# EAGLE design 32nbIoT (EAGLE 9.0.0)
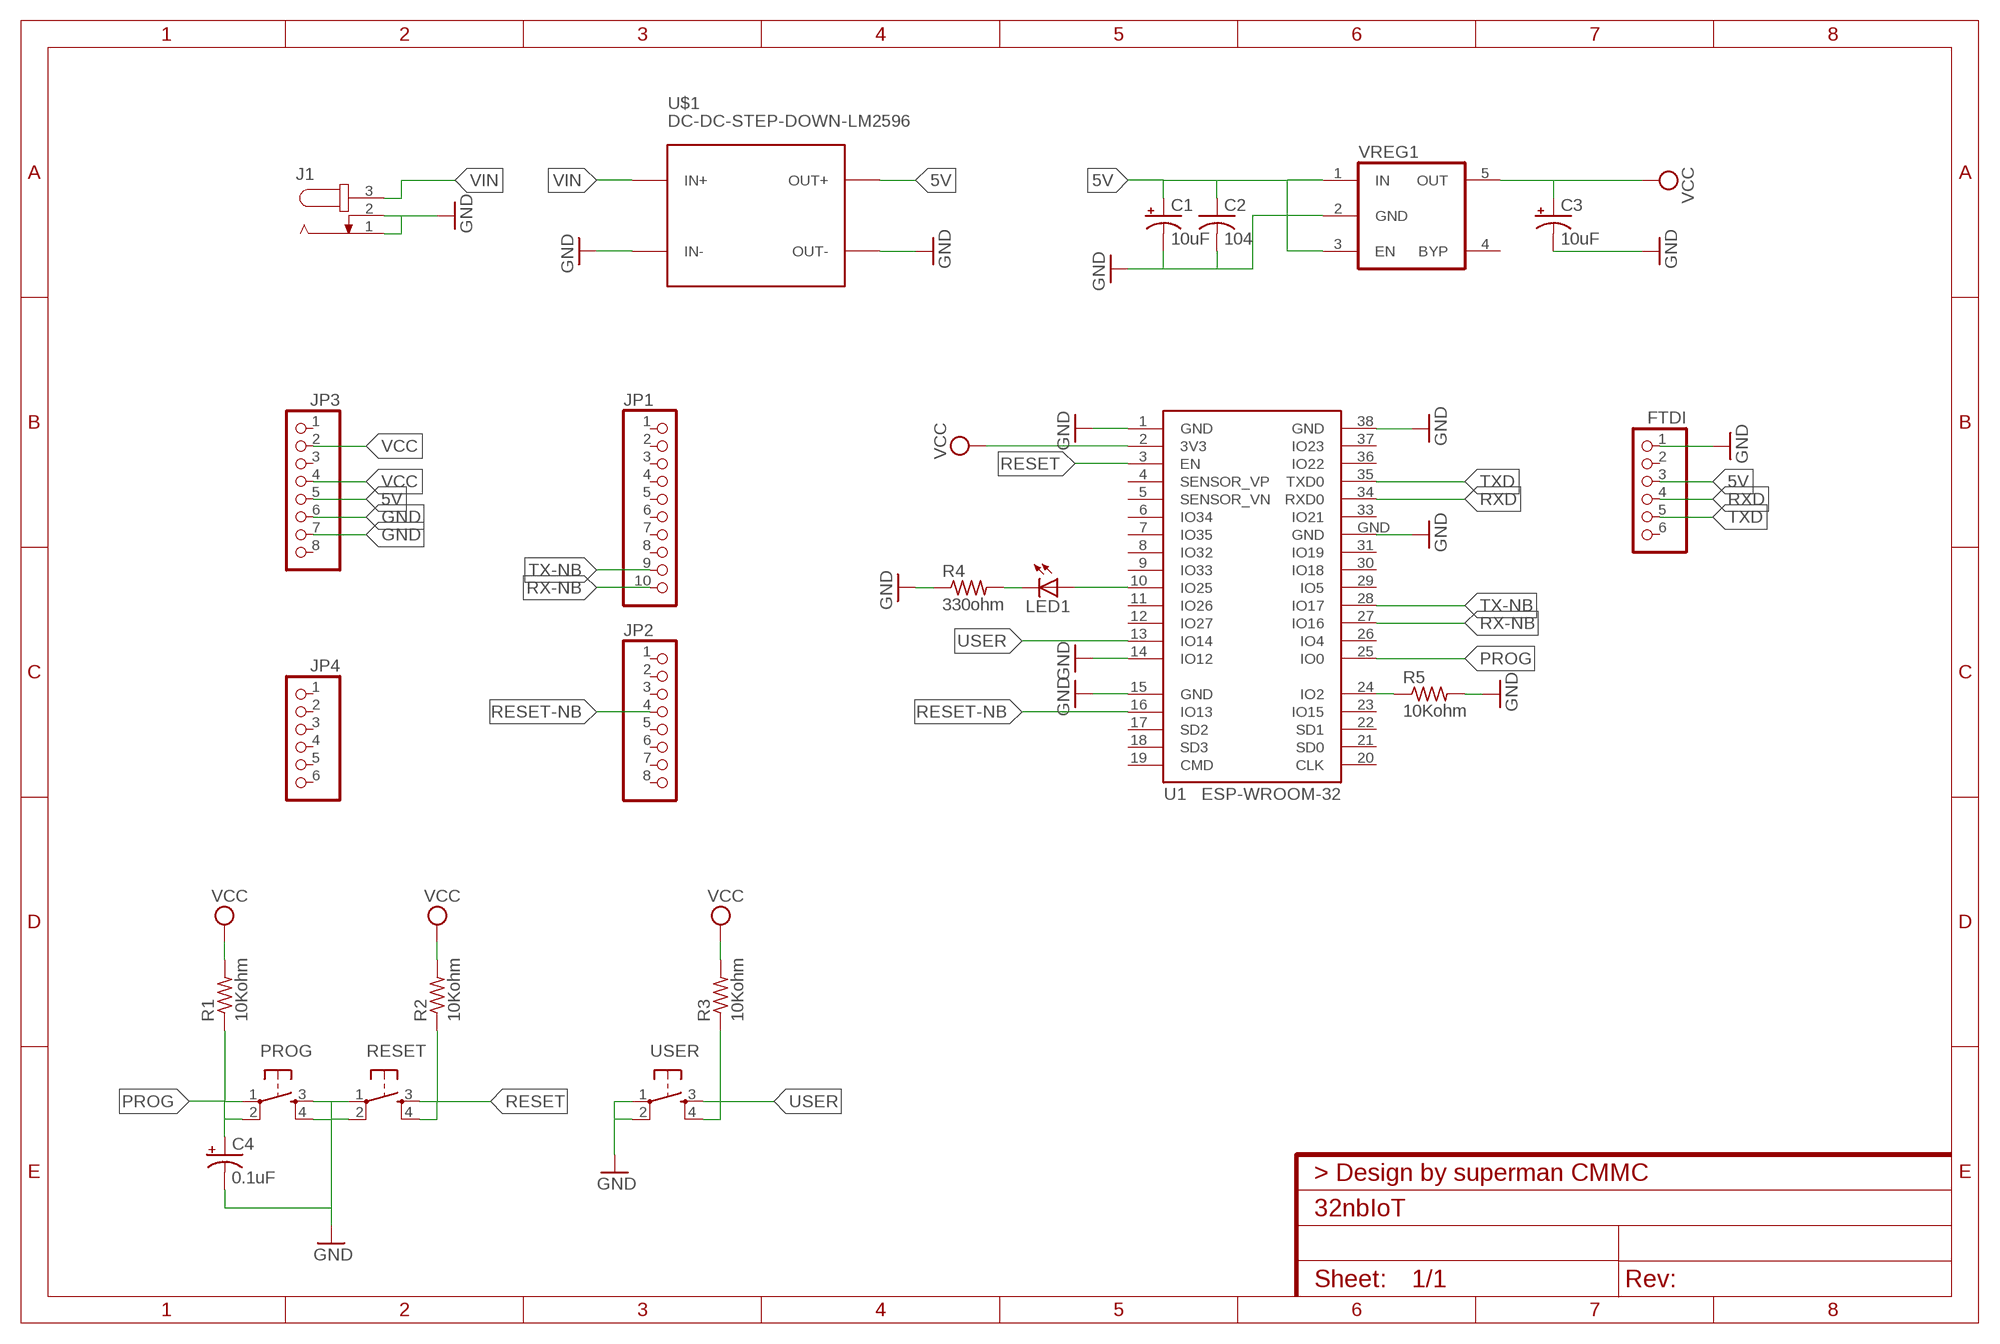
[diagram p0: schematic, sheet 1]

## Parts
C1  10uF  CPOL-USE2.5-6  [E2,5-6]
C2  104  C-US050-024X044  [C050-024X044]
C3  10uF  CPOL-USE2.5-6  [E2,5-6]
C4  0.1uF  CPOL-USE2.5-6  [E2,5-6]
FTDI  PINHD-1X6  [1X06]
J1  JACK-PLUG1  [SPC4078]
JP1  PINHD-1X10  [1X10]
JP2  PINHD-1X8  [1X08]
JP3  PINHD-1X8  [1X08]
JP4  PINHD-1X6  [1X06]
LED1  LED5MM  [LED5MM]
PROG  TAC_SWITCHPTH  [TACTILE-PTH]
R1  10Kohm  R-US_0207/10  [0207/10]
R2  10Kohm  R-US_0207/10  [0207/10]
R3  10Kohm  R-US_0207/10  [0207/10]
R4  330ohm  R-US_0207/10  [0207/10]
R5  10Kohm  R-US_0207/10  [0207/10]
RESET  TAC_SWITCHPTH  [TACTILE-PTH]
U1  ESP-WROOM-32  [ESP-WROOM-32]
U$1  DC-DC-STEP-DOWN-LM2596  [DC-DC-STEP-DOWN-LM2596]
USER  TAC_SWITCHPTH  [TACTILE-PTH]
VREG1  VREG_5PINS-SOT-23-5  [SOT-23-5]

## Nets
5V: C1.+ C2.1 FTDI.3 JP3.5 U$1.OUT+ VREG1.1(IN) VREG1.3(EN)
GND: C1.- C2.2 C3.- C4.- FTDI.1 J1.1 J1.2 JP3.6 JP3.7 PROG.3 PROG.4 R4.1 R5.2 RESET.1 RESET.2 U1.1(GND) U1.14(IO12) U1.15(GND) U1.38(GND) U1.GND U$1.IN- U$1.OUT- USER.1 USER.2 VREG1.2(GND)
N$1: LED1.K(C) R4.2
N$2: LED1.A U1.10(IO25)
N$3: R5.1 U1.24(IO2)
PROG: C4.+ PROG.1 PROG.2 R1.1 U1.25(IO0)
RESET: R2.1 RESET.3 RESET.4 U1.3(EN)
RESET-NB: JP2.4 U1.16(IO13)
RX-NB: JP1.10 U1.27(IO16)
RXD: FTDI.4 U1.34(RXD0)
TX-NB: JP1.9 U1.28(IO17)
TXD: FTDI.5 U1.35(TXD0)
USER: R3.1 U1.13(IO14) USER.3 USER.4
VCC: C3.+ JP3.2 JP3.4 R1.2 R2.2 R3.2 U1.2(3V3) VREG1.5(OUT)
VIN: J1.3 U$1.IN+
Unconnected: FTDI.2 FTDI.6 JP1.1 JP1.2 JP1.3 JP1.4 JP1.5 JP1.6 JP1.7 JP1.8 JP2.1 JP2.2 JP2.3 JP2.5 JP2.6 JP2.7 JP2.8 JP3.1 JP3.3 JP3.8 JP4.1 JP4.2 JP4.3 JP4.4 JP4.5 JP4.6 U1.4(SENSOR_VP) U1.5(SENSOR_VN) U1.6(IO34) U1.7(IO35) U1.8(IO32) U1.9(IO33) U1.11(IO26) U1.12(IO27) U1.17(SD2) U1.18(SD3) U1.19(CMD) U1.20(CLK) U1.21(SD0) U1.22(SD1) U1.23(IO15) U1.26(IO4) U1.29(IO5) U1.30(IO18) U1.31(IO19) U1.33(IO21) U1.36(IO22) U1.37(IO23) VREG1.4(BYP)

## Library data of the parts
C1 C3 C4 = adafruit:CPOL-US: POLARIZED CAPACITOR, American symbol
C2 = rcl:C-US: CAPACITOR, American symbol; SPICEPREFIX: C
FTDI JP4 = pinhead:PINHD-1X6: PIN HEADER
J1 = con-jack:JACK-PLUG: DC POWER JACK Power Jack, DC, Right Angle, Through Hole, Rated 5A at 16VDC, PC Terminals Distributor: Farnell (www.Farnell.de) Drawing: 84N1161.pdf / 84N1162.pdf Manufacturer: SPC Technology (www.spctechnology.com) Type: SPC4077 / SPC 4078; OC_FARNELL: unknown; OC_NEWARK: unknown
JP1 = pinhead:PINHD-1X10: PIN HEADER
JP2 JP3 = pinhead:PINHD-1X8: PIN HEADER
LED1 = adafruit:LED: LED OSRAM: - CHIPLED LG R971, LG N971, LY N971, LG Q971, LY Q971, LO R971, LY R971 LH N974, LH R974 LS Q976, LO Q976, LY Q976 LO Q996 - Hyper CHIPLED LW Q18S LB Q993, LB Q99A, LB R99A - SideLED LS A670, LO A670, LY A670, LG A670, LP A670 LB A673, LV A673, LT A673, LW A673 LH A674 LY A675 LS A676, LA A676, LO A676, LY A676, LW A676 LS A679, LY A679, LG A679 - Hyper Micro SIDELED® LS Y876, LA Y876, LO Y876, LY Y876 LT Y87S - SmartLED LW L88C, LW L88S LB L89C, LB L89S, LG L890 LS L89K, LO L89K, LY L89K LS L896, LA L896, LO L896, LY L896 - TOPLED LS T670, LO T670, LY T670, LG T670, LP T670 LSG T670, LSP T670, LSY T670, LOP T670, LYG T670 LG T671, LOG T671, LSG T671 LB T673, LV T673, LT T673, LW T673 LH T674 LS T676, LA T676, LO T676, LY T676, LB T676, LH T676, LSB T676, LW T676 LB T67C, LV T67C, LT T67C, LS T67K, LO T67K, LY T67K, LW E67C LS E67B, LA E67B, LO E67B, LY E67B, LB E67C, LV E67C, LT E67C LW T67C LS T679, LY T679, LG T679 LS T770, LO T770, LY T770, LG T770, LP T770 LB T773, LV T773, LT T773, LW T773 LH T774 LS E675, LA E675, LY E675, LS T675 LS T776, LA T776, LO T776, LY T776, LB T776 LHGB T686 LT T68C, LB T68C - Hyper Mini TOPLED® LB M676 - Mini TOPLED Santana® LG M470 LS M47K, LO M47K, LY M47K Source: http://www.osram.convergy.de/
PROG RESET USER = SparkFun-Retired:TAC_SWITCH: Momentary Switch Button commonly used for reset or general input. Spark Fun Electronics SKU : COM-00097 SMT- SWCH-08247
R1-R5 = adafruit:R-US_: RESISTOR, American symbol
U1 = esp32:ESP-WROOM-32: Espressif Systems ESP-WROOM-32
U$1 = diy-modules:DC-DC-STEP-DOWN-LM2596: DC/DC Step-Down Regulator based on LM2596-ADJ chip LM2596 datasheet available here: http://www.ti.com/lit/ds/symlink/lm2596.pdf Click here to find device on ebay.com <http://www.ebay.com/sch/lm2596+power+regulator>
VREG1 = dp_devices:VREG_5PINS: 5 pins voltage regulator

## Board
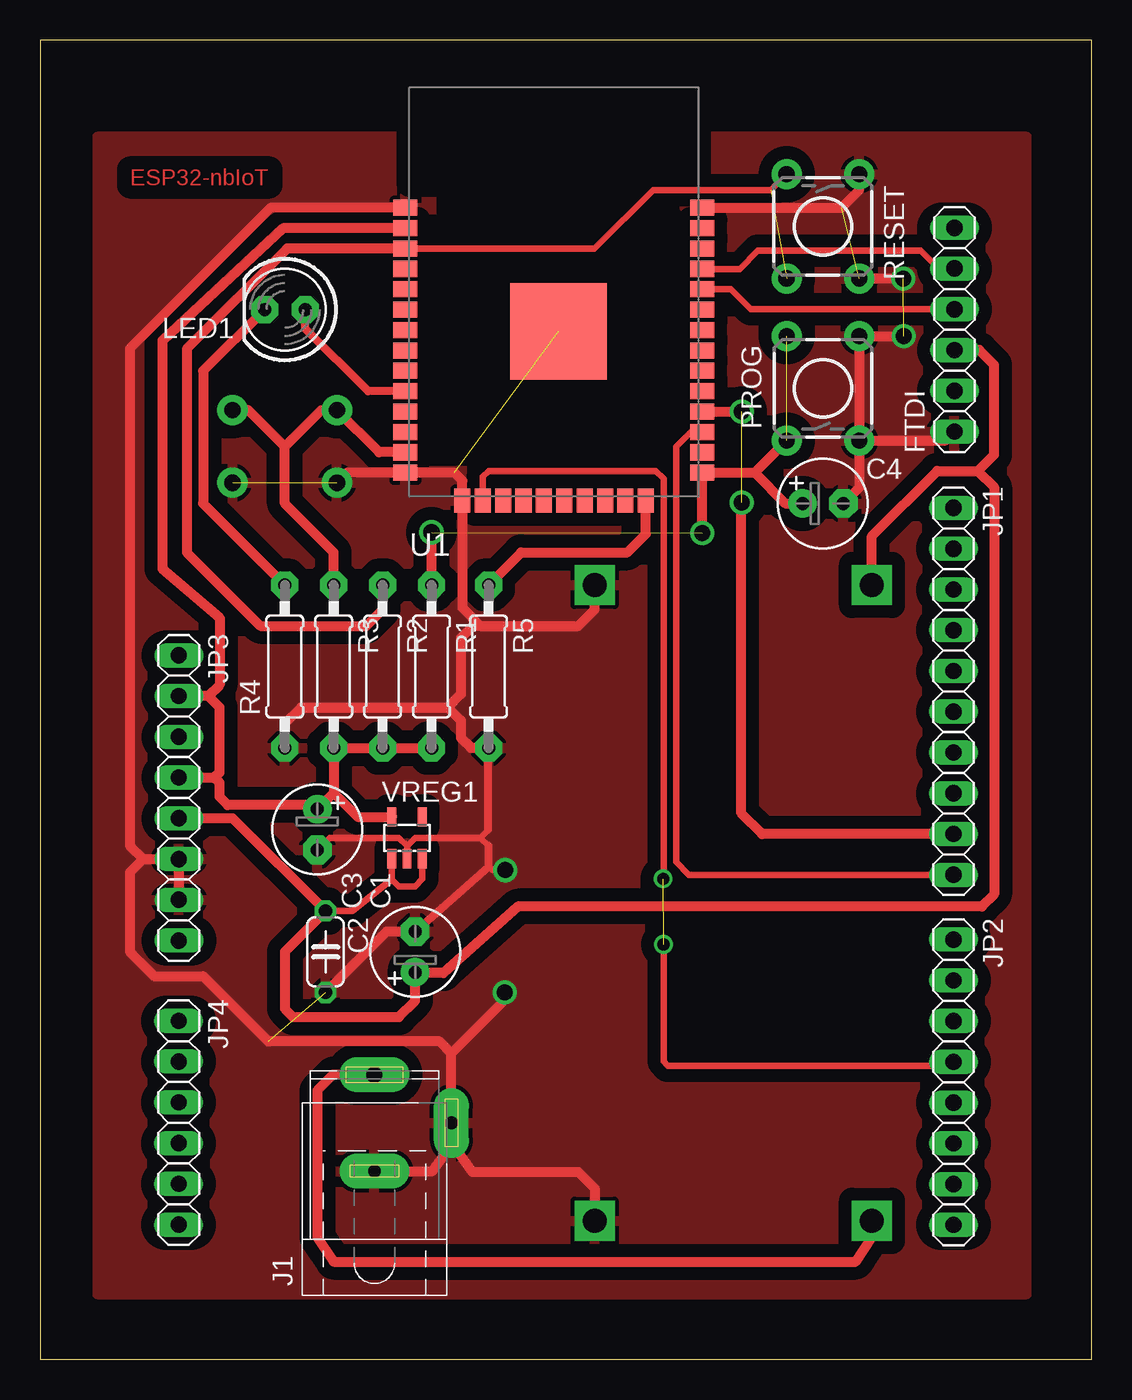
[diagram p1: board, top side]
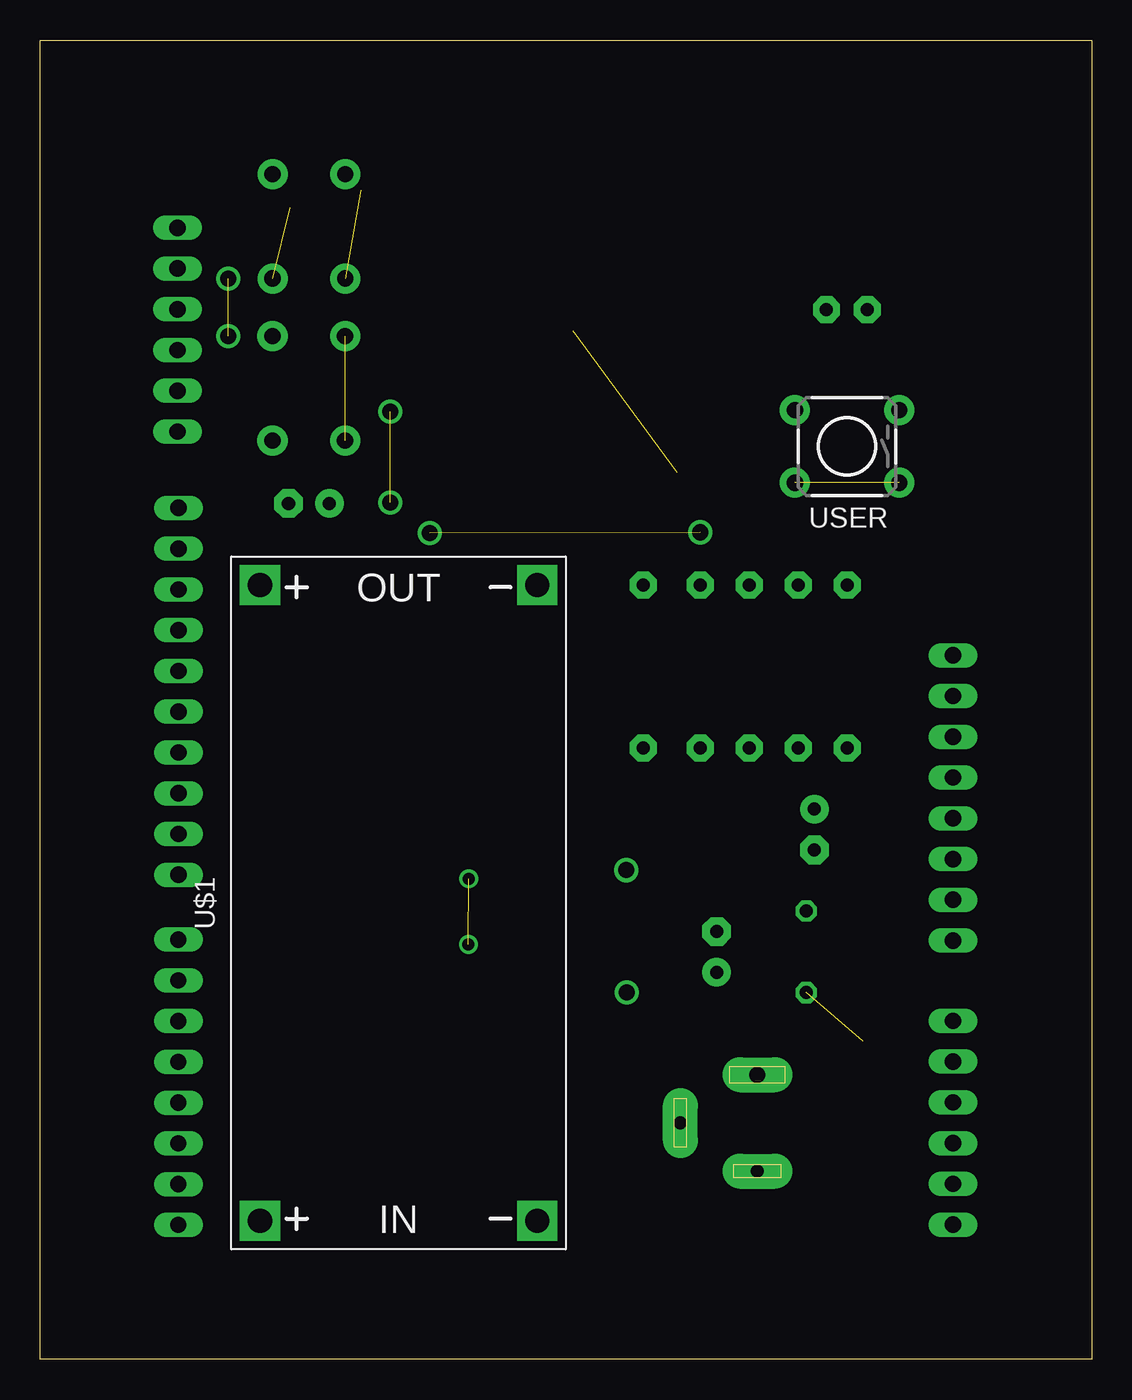
[diagram p2: board, bottom side, seen from below]

Size 65.51 x 82.22 mm. Coordinates in mm from the lower left corner, seen from the top.
Outline: 0,0 65.51,0 65.51,82.22 0,82.22 0,0
Copper layers (1*16): Top 0.035mm / dielectric 1.5mm / Bottom 0.035mm
Design rules "default": minimum track width 6mil, minimum drill 0.35mm, track to track 6mil, track to pad 6mil, pad to pad 6mil, via to via 6mil, smd to smd 6mil, copper to edge 40mil, drill to drill 6mil, minimum pad ring 10mil, minimum via ring 8mil, stop-mask expansion 4mil, vias tented up to drill 0mil, thermal gap 10mil

### Footprints (pad centres in the part's own frame; a part is rotated, then mirrored left to right if it is on the bottom)
E2,5-6 = drill 0.813 pad 1.778: + -1.27,0 | drill 0.813 pad 1.778 octagon: - 1.27,0
C050-024X044 = drill 0.813 octagon: 1 -2.54,0; 2 2.54,0
1X06 = drill 1.016 long: 1 -6.35,0; 2 -3.81,0; 3 -1.27,0; 4 1.27,0; 5 3.81,0; 6 6.35,0
SPC4078 = drill 0.8 pad 2.184 long: 1 -3,0; 2 0,-4.8 | drill 1 pad 2.184 long: 3 3,0
1X10 = drill 1.016 long: 1 -11.43,0; 2 -8.89,0; 3 -6.35,0; 4 -3.81,0; 5 -1.27,0; 6 1.27,0; 7 3.81,0; 8 6.35,0; 9 8.89,0; 10 11.43,0
1X08 = drill 1.016 long: 1 -8.89,0; 2 -6.35,0; 3 -3.81,0; 4 -1.27,0; 5 1.27,0; 6 3.81,0; 7 6.35,0; 8 8.89,0
LED5MM = drill 0.813 pad 1.676 octagon: A -1.27,0; K 1.27,0
TACTILE-PTH = drill 1.016 pad 1.88: 1 -3.251,2.261; 2 3.251,2.261; 3 -3.251,-2.261; 4 3.251,-2.261
0207/10 = drill 0.813 pad 1.676 octagon: 1 -5.08,0; 2 5.08,0
ESP-WROOM-32 = smd 1.5 x 1: 1 -9.25,7; 2 -9.25,5.73; 3 -9.25,4.46; 4 -9.25,3.19; 5 -9.25,1.92; 6 -9.25,0.65; 7 -9.25,-0.62; 8 -9.25,-1.89; 9 -9.25,-3.16; 10 -9.25,-4.43; 11 -9.25,-5.7; 12 -9.25,-6.97; 13 -9.25,-8.24; 14 -9.25,-9.51; 25 9.25,-9.51; 26 9.25,-8.24; 27 9.25,-6.97; 28 9.25,-5.7; 29 9.25,-4.43; 30 9.25,-3.16; 31 9.25,-1.89; 32 9.25,-0.62; 33 9.25,0.65; 34 9.25,1.92; 35 9.25,3.19; 36 9.25,4.46; 37 9.25,5.73; 38 9.25,7 | smd 1 x 1.5: 15 -5.7,-11.25; 16 -4.43,-11.25; 17 -3.16,-11.25; 18 -1.89,-11.25; 19 -0.62,-11.25; 20 0.65,-11.25; 21 1.92,-11.25; 22 3.19,-11.25; 23 4.46,-11.25; 24 5.73,-11.25 | smd 6 x 6: GND 0.3,-0.7
DC-DC-STEP-DOWN-LM2596 = drill 1.5 pad 2.5 square: IN+ -19.812,8.636; IN- -19.812,-8.636; OUT+ 19.812,8.636; OUT- 19.812,-8.636
SOT-23-5 = smd 0.55 x 1.2: 1 -0.95,-1.3; 2 0,-1.3; 3 0.95,-1.3; 4 0.95,1.3; 5 -0.95,1.3

### Placement (x,y rotation side)
C1  23.37,25.4 90 top
C2  17.78,25.4 270 top
C3  17.27,33.02 270 top
C4  48.77,53.34 0 top
FTDI  56.96,64.17 90 top
J1  20.83,14.73 90 top
JP1  56.9,41.63 270 top
JP2  56.9,17.27 270 top
JP3  8.64,34.99 270 top
JP4  8.63,14.75 270 top
LED1  15.25,65.43 180 top
PROG  48.77,60.52 90 top
R1  24.38,43.18 270 top
R2  21.34,43.18 270 top
R3  18.29,43.18 270 top
R4  15.24,43.18 90 top
R5  27.94,43.18 270 top
RESET  48.77,70.61 270 top
U1  32,64.77 0 top
U$1  43.18,28.45 90 bottom
USER  15.24,56.9 180 bottom
VREG1  22.86,32.51 0 top

### Tracks (layer width: path | path; a pad name or v marks a point on that pad's centre or on a via)
5V
  Top 0.406: VREG1.1 21.91,29.91 | 21.91,29.91 22.35,29.46 23.37,29.46 23.82,29.93 23.81,29.93 VREG1.3 | 21.91,29.91 19.44,27.94 C2.1 | 23.25,24.13 C1.+
  Top 0.61: U$1.OUT+ 51.82,51.31 55.88,55.37 58.42,55.37 | 58.42,55.37 59.44,56.39 59.44,61.98 58.51,62.9 FTDI.3 | C1.+ 23.37,22.35 22.35,21.34 15.75,21.34 15.24,21.84 15.24,25.4 C2.1 12,33.72 JP3.5 | 58.42,55.37 59.44,54.36 59.44,28.98 58.67,28.22 29.77,28.22 25.12,24.08 23.3,24.08 23.25,24.13
GND  (via drill 1 pad 0.9)  (5 unrouted)
  Top 0.406: 22.86,32 VREG1.2 | 22.86,32 22.35,32.51 18.03,32.51 C3.- | 22.86,32 23.37,32.51 27.43,32.51 | 27.43,32.51 27.92,33 27.92,33.02 | 27.94,32 27.43,32.51 | 27.94,30.73 28.18,30.49 v28.98,30.49
  Top 0.508: 27.92,33.02 27.92,38.12 | 27.94,32 27.94,30.73 C1.-
  Top 0.61: U1.1 14.37,71.77 5.59,62.99 5.59,32 6.41,31.18 | 6.41,31.18 JP3.6 JP3.7 | USER.2 19.12,55.26 U1.14 25.81,55.25 26.3,54.76 U1.15 26.3,46.85 27.43,45.72 | U1.38 49.93,71.77 51.03,72.87 RESET.1 | PROG.3 51.03,54.34 C4.- | PROG.3 PROG.4 v53.79,63.77 v53.8,63.77 | PROG.3 56.4,57.26 FTDI.1 | 27.43,45.72 33.53,45.72 34.54,46.74 U$1.OUT- | 27.43,45.72 26.97,45.72 26.22,44.97 26.22,41.46 25.4,40.64 | R5.2 27.92,38.12 26.82,38.12 26.22,38.73 26.22,39.82 25.4,40.64 | R4.1 15.24,39.62 16.26,40.64 25.4,40.64 | J1.1 24.43,11.73 25.91,13.72 25.63,14 J1.2 | J1.2 25.63,13.49 26.92,11.68 33.53,11.68 34.54,10.67 U$1.IN- | C2.2 21.59,26.67 C1.- | 6.41,31.18 5.59,30.36 5.59,25.4 7.11,23.88 10.16,23.88 14.22,19.81 24.89,19.81 25.63,19.08 | J1.2 25.63,19.08 | v53.78,67.35 RESET.2 | 25.63,19.08 28.96,22.4 v28.96,22.86
  pour Top (isolate 0.813): 24.38,76.2 3.56,76.2 3.56,4.06 61.47,4.06 61.47,76.2 39.62,76.2 39.62,55.37 24.38,55.37
N$1
  Top 0.61: LED1.K 10.16,61.61 10.16,53.34 R4.2
N$2
  Top 0.508: U1.10 20.43,60.34 16.52,64.25 LED1.A
N$3
  Top 0.61: R5.1 29.97,50.29 36.58,50.29 37.73,51.45 U1.24
PROG  (via drill 1 pad 0.9)  (2 unrouted)
  Top 0.61: 44.51,55.26 U1.25 41.25,51.52 v41.24,51.51 | 44.51,55.26 PROG.1 | 44.51,55.26 46.43,53.34 C4.+ | R1.1 v24.38,51.54
RESET  (1 unrouted)
  Top 0.406: U1.3 34.54,69.23 38.19,72.88 45.52,72.88 RESET.3
  Top 0.61: U1.3 15.38,69.23 9.14,62.99 9.14,50.29 13.72,45.72 20.32,45.72 21.34,46.74 R2.1
RESET-NB  (via drill 0.75 pad 0.9)  (1 unrouted)
  Top 0.406: U1.16 27.57,55.01 27.94,55.37 38.37,55.37 38.85,54.89 38.85,30 v38.81,29.95 | v38.84,25.86 38.84,18.57 39.12,18.29 56.65,18.29 JP2.4
RX-NB
  Top 0.406: JP1.10 40.41,30.2 39.62,30.99 39.62,56.9 40.53,57.8 U1.27
RXD
  Top 0.406: FTDI.4 44.28,65.44 43.04,66.69 U1.34
TX-NB  (via drill 1 pad 0.9)  (1 unrouted)
  Top 0.61: JP1.9 44.98,32.74 43.69,34.04 43.69,53.39 v43.7,53.4 | U1.28 v43.7,59.07 v43.71,59.06
TXD
  Top 0.406: U1.35 43.58,67.96 44.7,69.09 54.86,69.09 55.97,67.98 FTDI.5
USER
  Top 0.61: U1.13 21.12,56.53 USER.4 17.5,59.16 15.24,56.9 | R3.1 18.29,50.29 15.24,53.34 15.24,56.9 | 15.24,56.9 12.98,59.16 USER.3
VCC
  Top 0.61: JP3.4 10.86,36.26 | 10.86,36.26 11.18,36.58 11.18,40.64 10.47,41.34 | 10.47,41.34 JP3.2 | 10.86,36.26 11.18,35.95 11.18,35.05 11.68,34.54 17.02,34.54 C3.+ 18.29,35.31 | U1.2 15.13,70.5 7.62,63.5 7.62,49.28 11.18,46.23 11.18,42.04 10.47,41.34 | R1.2 R2.2 R3.2 18.29,35.31 | 18.29,35.31 19.78,33.81 VREG1.5
VIN
  Top 0.61: J1.3 18.24,17.73 17.27,16.76 17.27,7.62 18.29,6.1 50.8,6.1 51.82,7.62 U$1.IN+

### Text on the board
Top: ESP32-nbIoT